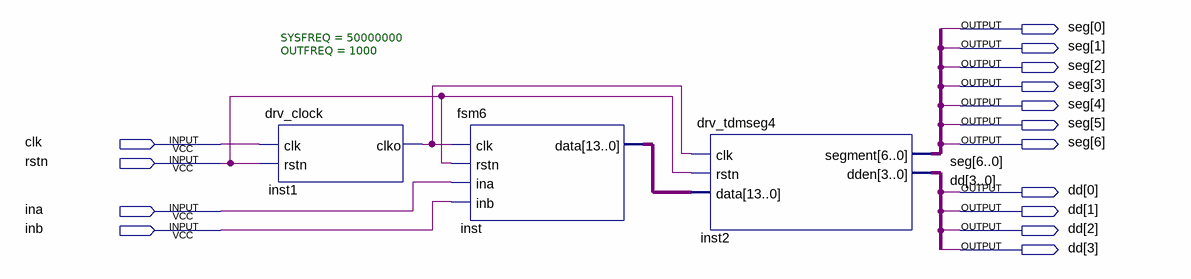
[diagram p0: schematic sheet]
// Quartus schematic dig2lab6.bdf as structural Verilog: 3 symbols, 15 pins
module dig2lab6 (
  input  clk,
  input  rstn,
  input  ina,
  input  inb,
  output [6:0] seg,
  output [3:0] dd
);

  wire inst1_clko;
  wire [13:0] inst_data;

  drv_clock #(.SYSFREQ(50000000), .OUTFREQ(1000)) inst1 (.clk(clk), .rstn(rstn), .clko(inst1_clko));
  fsm6 inst (.clk(inst1_clko), .rstn(rstn), .ina(ina), .inb(inb), .data(inst_data));
  drv_tdmseg4 inst2 (.clk(inst1_clko), .rstn(rstn), .data(inst_data), .segment(seg), .dden(dd));
endmodule
